# EasyEDA Pro project _SHA-PCB V1.1  30 23_2024-08-26.epro, schematic Schematic1

## Sheets
1 P1: Create Date: 2024-07-31; Page Name: P1; Project Name: SHA-PCB V1.1 30 23; Schematic Name: Schematic1; Update Date: 2024-07-31; Company: Sai Automations; Drawed: EasyEDA Pro; Page Size: A4; Part Number: JLCPCB-002; Reviewed: EasyEDA Pro; Version: V0.1
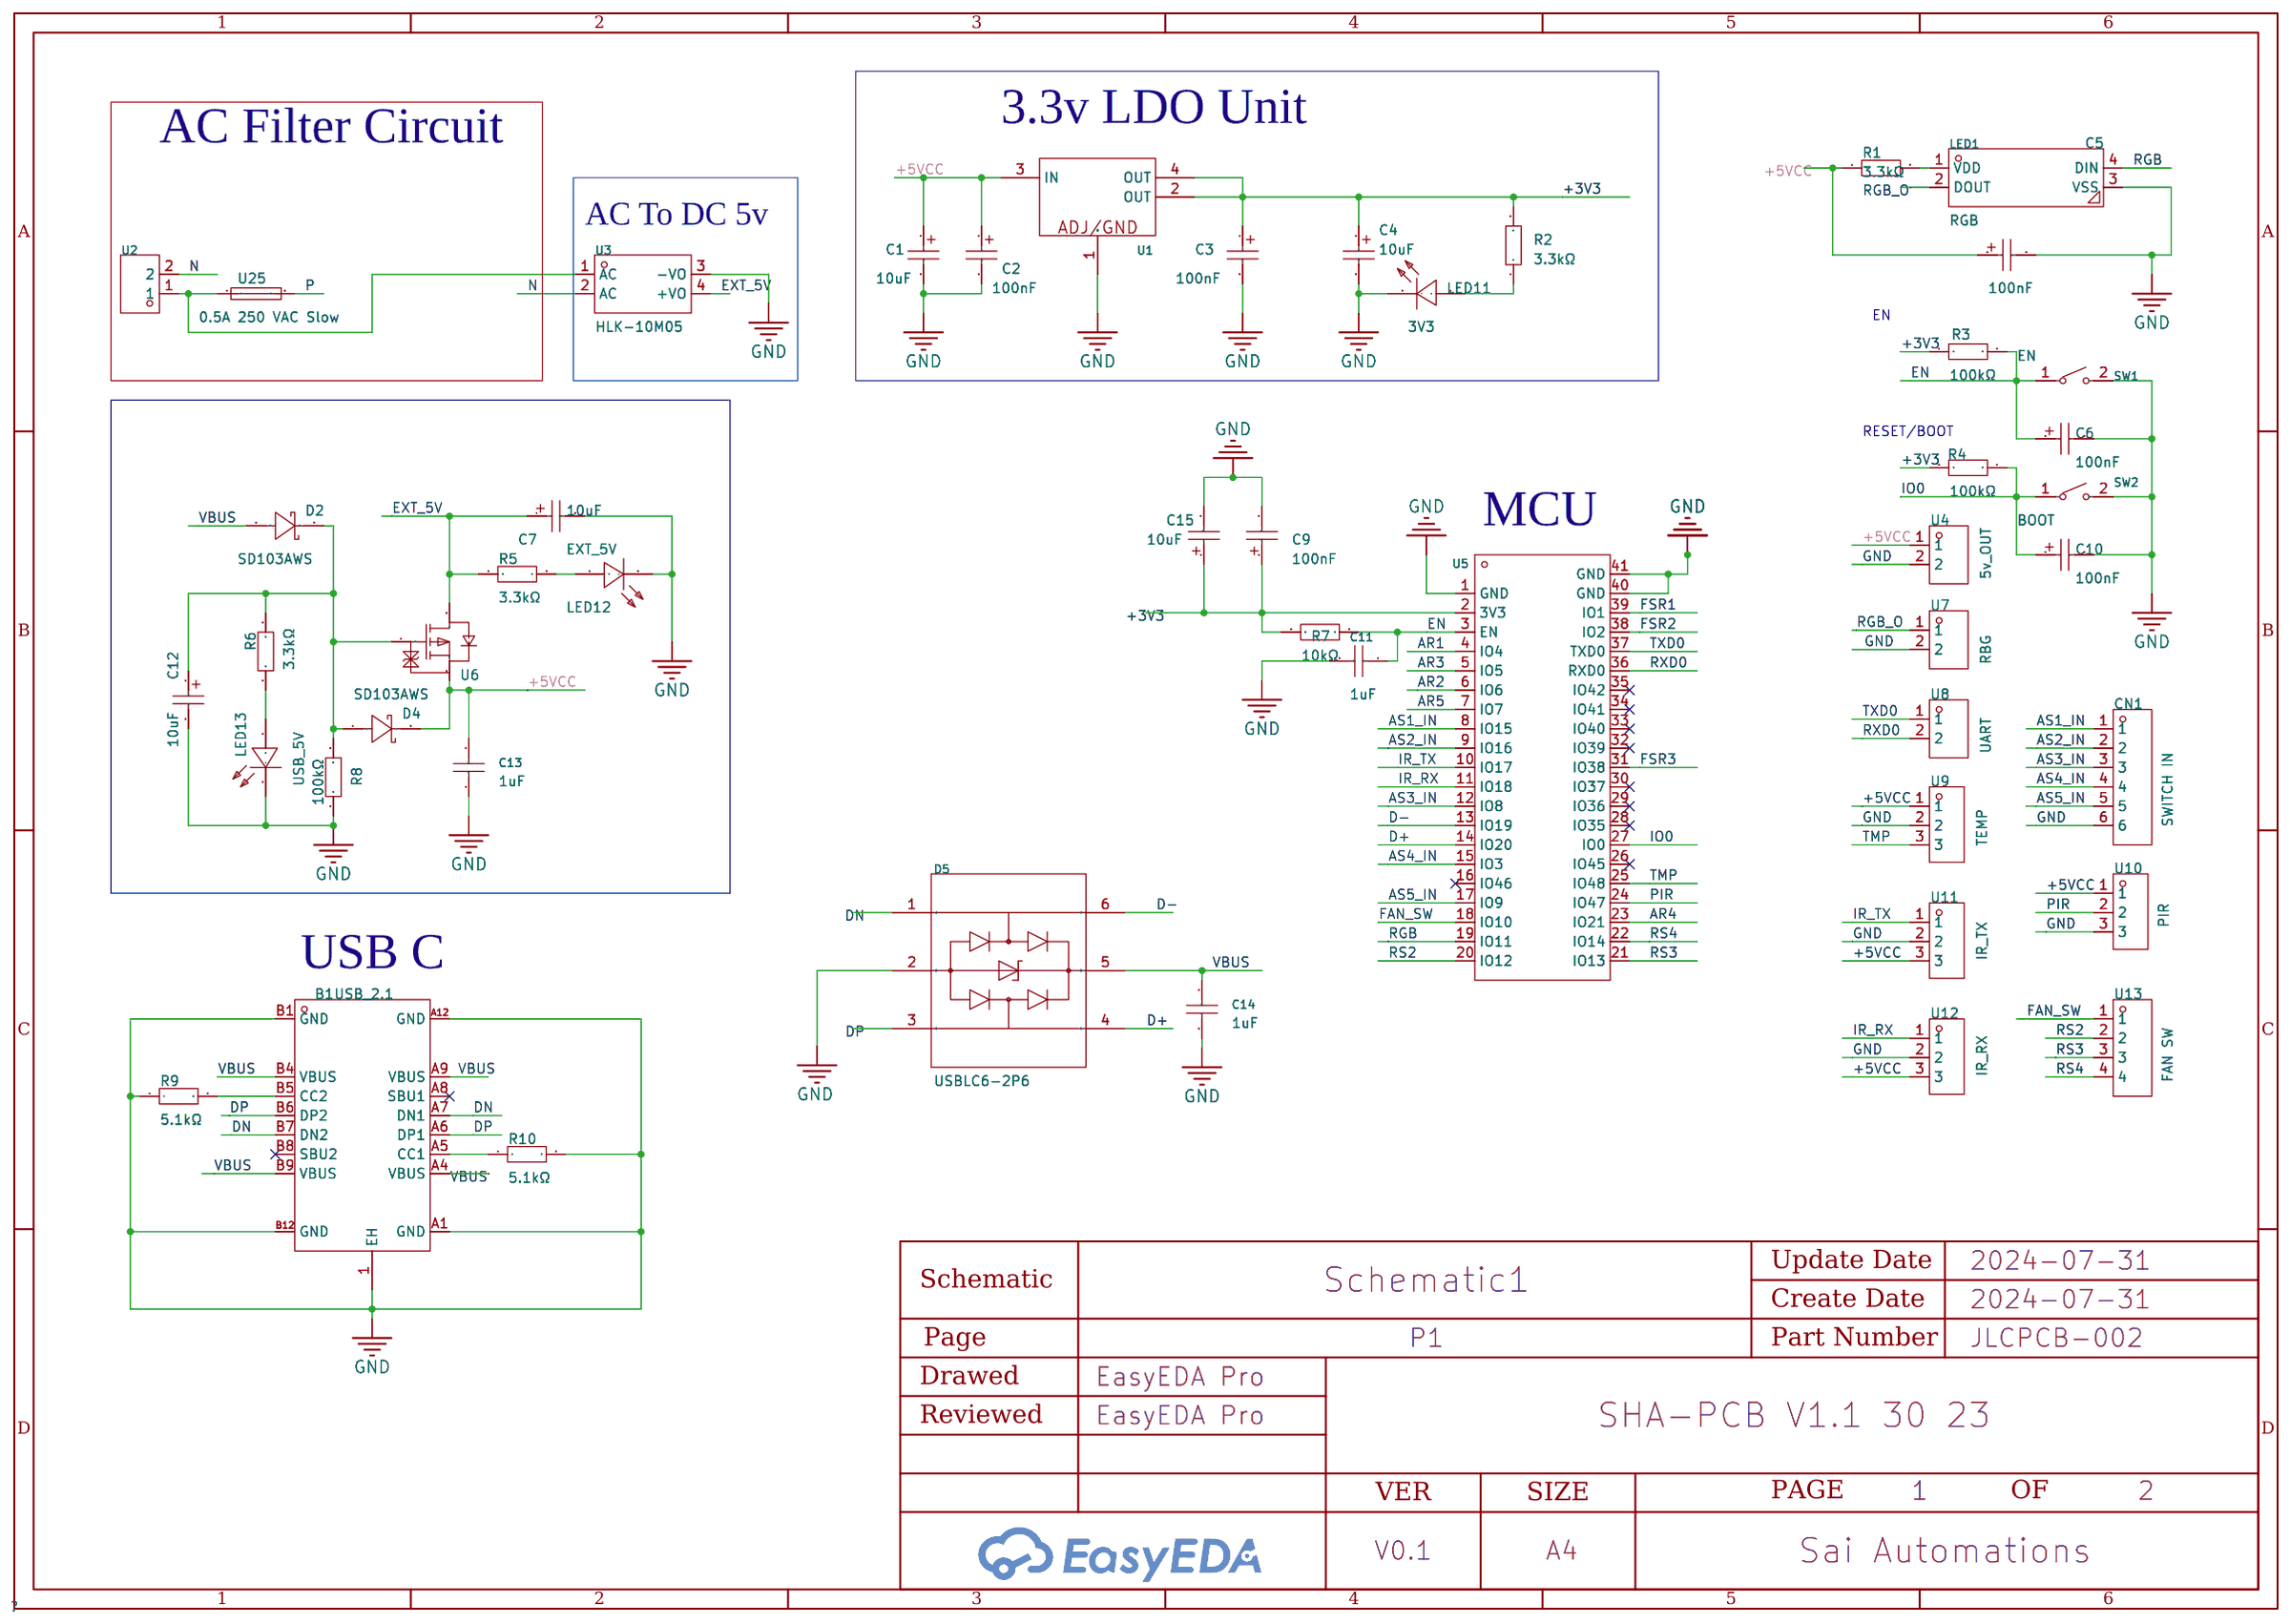
[diagram p0: P1]
2 P2: Create Date: 2024-01-13; Page Name: P2; Project Name: SHA-PCB V1.1; Update Date: 2024-07-18
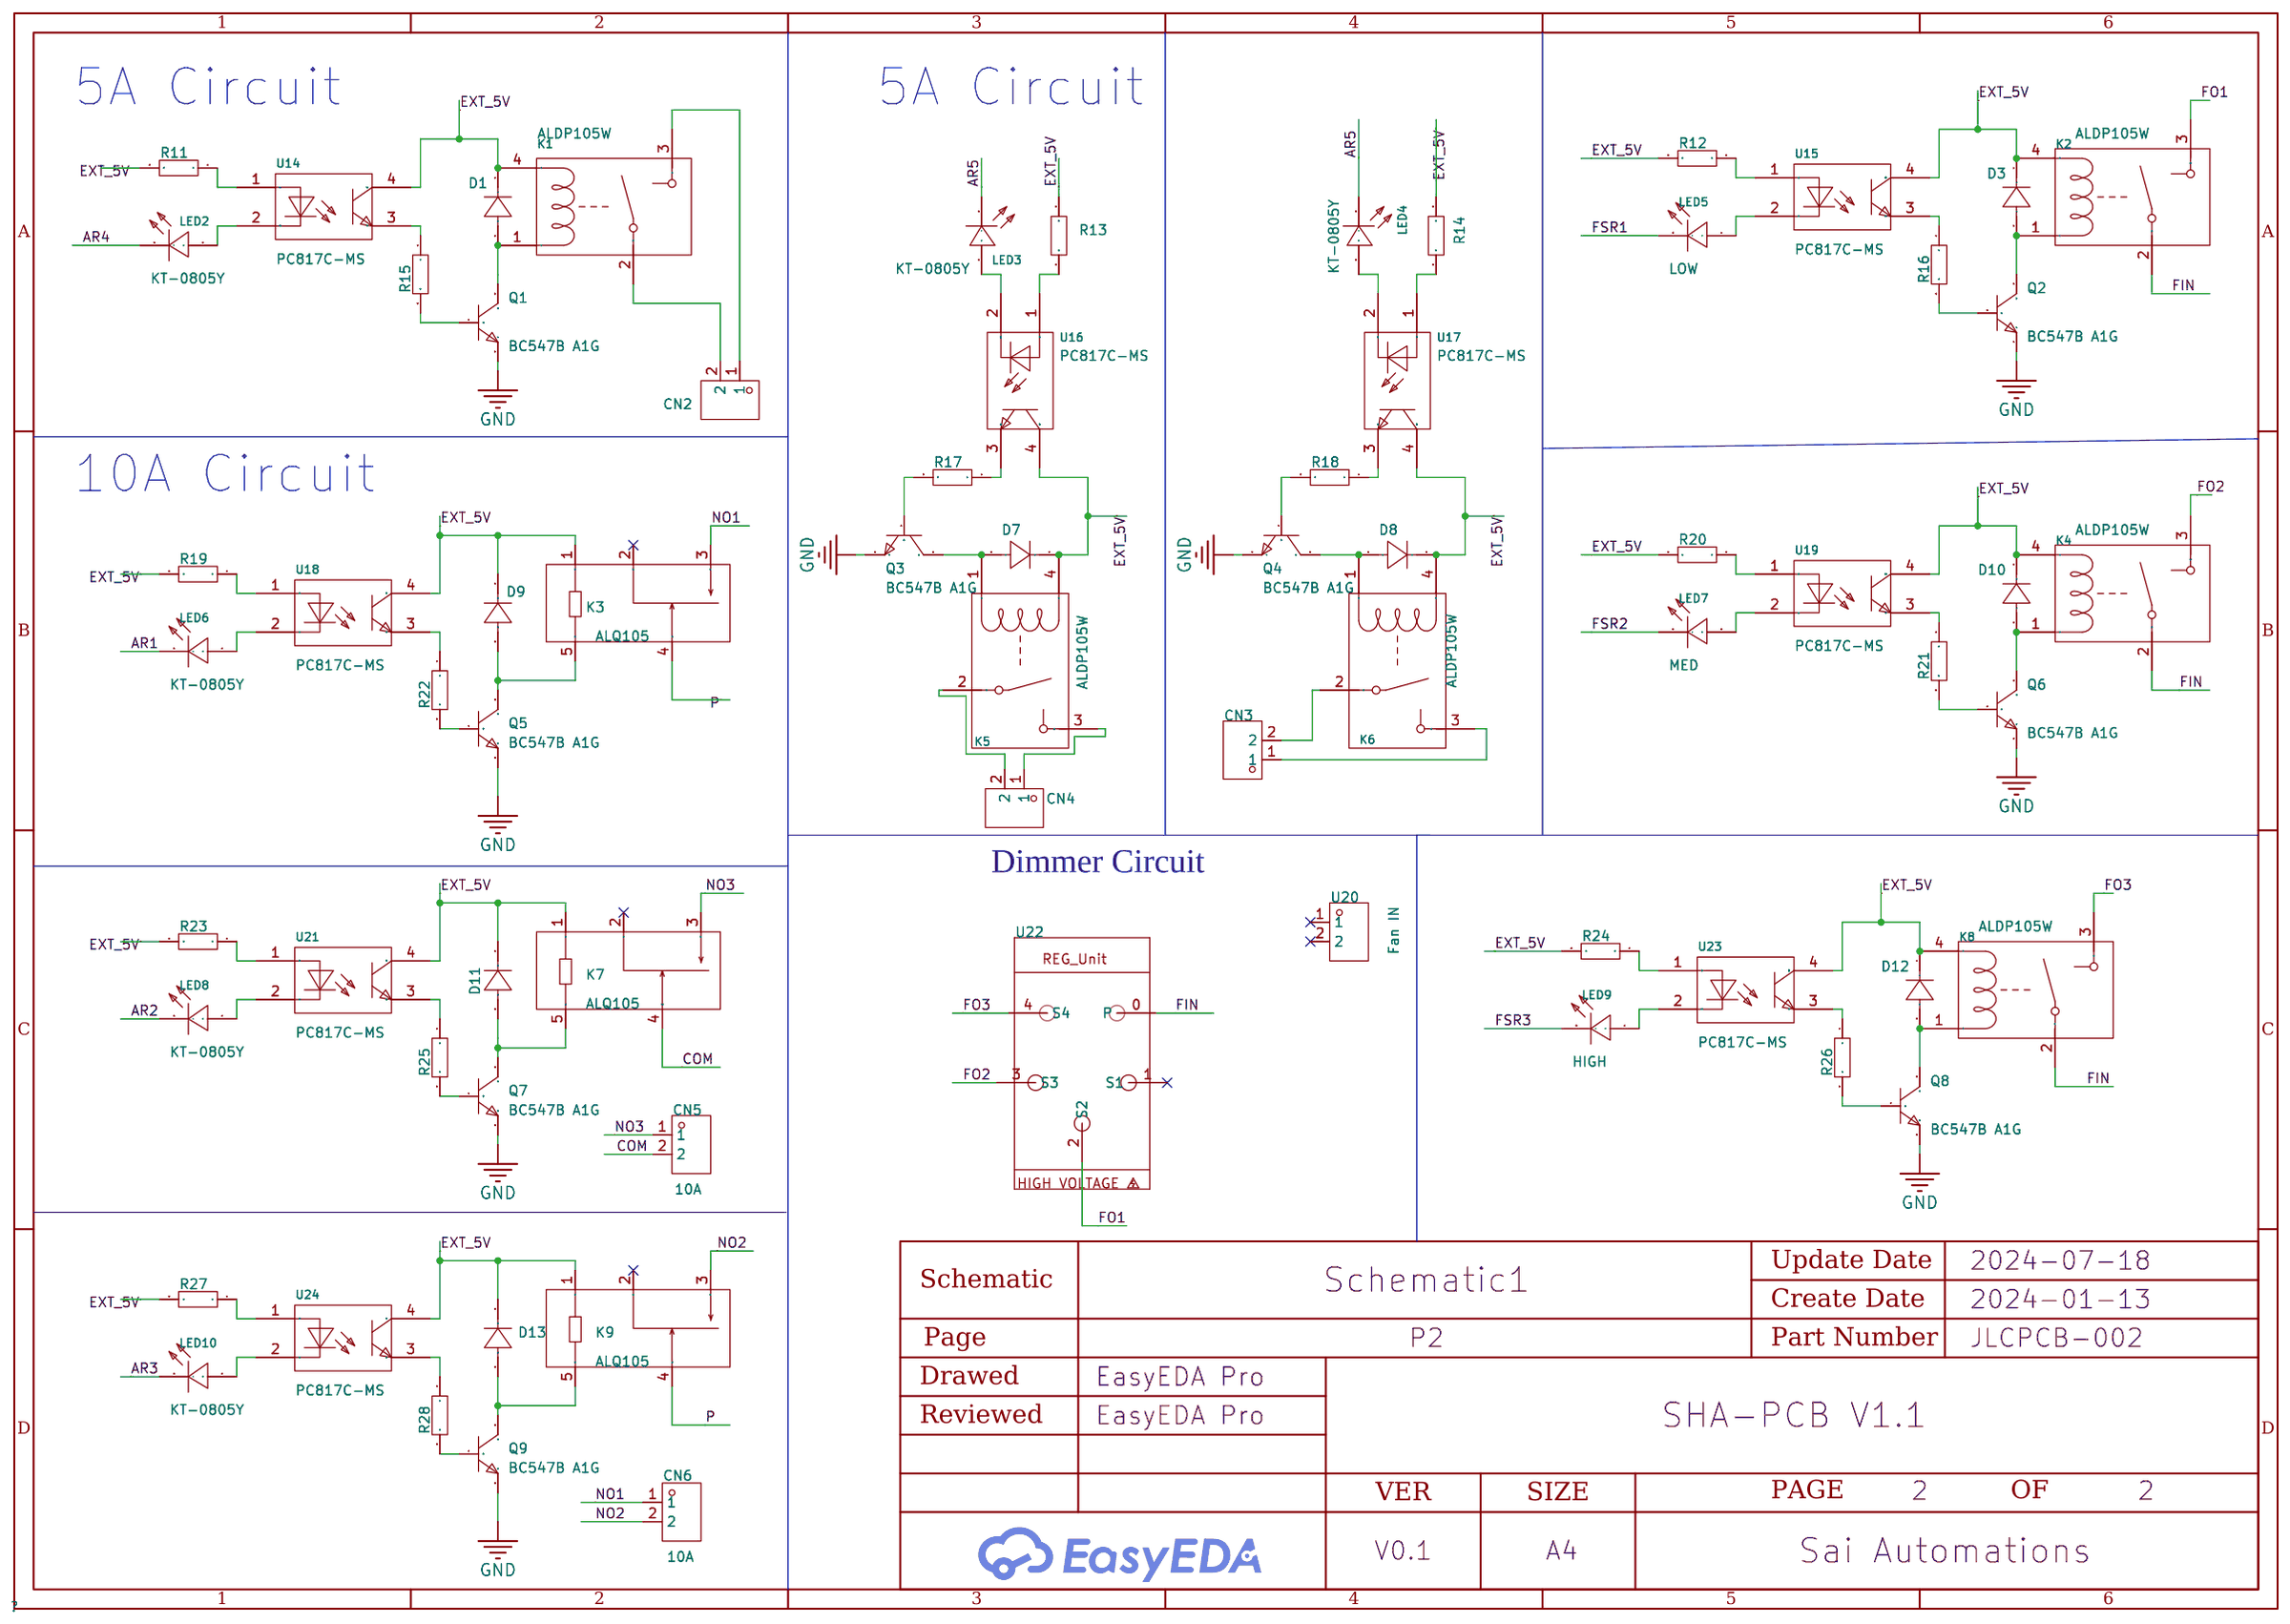
[diagram p1: P2]

## Parts
sheet P1
B1  USB_2.1  [TYPE-C-SMD_SBC-160S1A-20-S412]
C1  10uF  [CASE-A_3216]
C2  100nF  [CASE-A_3216]
C3  100nF  [CASE-A_3216]
C4  10uF  [CASE-A_3216]
C5  100nF  [CASE-A_3216]
C6  100nF  [CASE-A_3216]
C7  10uF  [CASE-A_3216]
C9  100nF  [CASE-A_3216]
C10  100nF  [CASE-A_3216]
C11  1uF  [C0402]
C12  10uF  [CASE-A_3216]
C13  1uF  [C0402]
C14  1uF  [C0402]
C15  10uF  [CASE-A_3216]
CN1  SWITCH IN  [CONN-TH_B6B-PH-K-S-GW]
D2  SD103AWS  [SOD-323_L1.8-W1.3-LS2.5-FD]
D4  SD103AWS  [SOD-323_L1.8-W1.3-LS2.5-FD]
D5  USBLC6-2P6  [SOT-666-6_L1.6-W1.2-P0.50-LS1.6-BR]
LED1  RGB  [LED-SMD_4P-L5.0-W5.0-BL_TC5050RGB]
LED11  3V3  [LED0805-R-RD]
LED12  EXT_5V  [LED0805-R-RD]
LED13  USB_5V  [LED0805-R-RD]
R1  3.3kΩ  [R0402]
R2  3.3kΩ  [R0402]
R3  100kΩ  [R0402]
R4  100kΩ  [R0402]
R5  3.3kΩ  [R0402]
R6  3.3kΩ  [R0402]
R7  10kΩ  [R0402]
R8  100kΩ  [R0402]
R9  5.1kΩ  [R0402]
R10  5.1kΩ  [R0402]
SW1  EN  [SW-SMD_L3.9-W3.0-P4.45]
SW2  BOOT  [SW-SMD_L3.9-W3.0-P4.45]
U1  AMS1117-3.3  [SOT-223-3_L6.4-W3.5-P2.30-LS7.0-BR]
U2  XY126V-5.0-2P  [CONN-TH_XY126V-5.0-2P]
U3  HLK-10M05  [PWRM-TH_HLK-10M05]
U4  5v_OUT  [CONN-TH_2P-P2.00_2B-PH-KL]
U5  ESP32-S3-WROOM-1-N4R8  [WIRELM-SMD_ESP32-S3-WROOM-1]
U6  CJ3139KDW-ES  [SOT-323-3_L2.1-W1.3-P1.30-LS2.3-BR]
U7  RBG  [CONN-TH_2P-P2.00_2B-PH-KL]
U8  UART  [CONN-TH_2P-P2.00_2B-PH-KL]
U9  TEMP  [3 PIN JST PH]
U10  PIR  [3 PIN JST PH]
U11  IR_TX  [3 PIN JST PH]
U12  IR_RX  [3 PIN JST PH]
U13  FAN SW  [JST 4PIN]
U25  0.5A 250 VAC Slow  [TH_2P-BLX-A]
sheet P2
CN2  XY2500R-G-3.5-2P  [CONN-TH_XY2500R-G-3.5-2P]
CN3  XY2500R-G-3.5-2P  [CONN-TH_XY2500R-G-3.5-2P]
CN4  XY2500R-G-3.5-2P  [CONN-TH_XY2500R-G-3.5-2P]
CN5  10A  [CONN-TH_2P-P5.08_XY2500R-D5.08-2P]
CN6  10A  [CONN-TH_XY2500R-G-3.5-2P]
D1  -  [SMA_L4.4-W2.8-LS5.4-RD]
D3  -  [SMA_L4.4-W2.8-LS5.4-RD]
D7  -  [SMA_L4.4-W2.8-LS5.4-RD]
D8  -  [SMA_L4.4-W2.8-LS5.4-RD]
D9  -  [SMA_L4.4-W2.8-LS5.4-RD]
D10  -  [SMA_L4.4-W2.8-LS5.4-RD]
D11  -  [SMA_L4.4-W2.8-LS5.4-RD]
D12  -  [SMA_L4.4-W2.8-LS5.4-RD]
D13  -  [SMA_L4.4-W2.8-LS5.4-RD]
K1  ALDP105W  [RELAY-TH_ALDP1XXW]
K2  ALDP105W  [RELAY-TH_ALDP1XXW]
K3  ALQ105  [RELAY-TH_ALQ1XX]
K4  ALDP105W  [RELAY-TH_ALDP1XXW]
K5  ALDP105W  [RELAY-TH_ALDP1XXW]
K6  ALDP105W  [RELAY-TH_ALDP1XXW]
K7  ALQ105  [RELAY-TH_ALQ1XX]
K8  ALDP105W  [RELAY-TH_ALDP1XXW]
K9  ALQ105  [RELAY-TH_ALQ1XX]
LED2  KT-0805Y  [LED0805-R-RD]
LED3  KT-0805Y  [LED0805-R-RD]
LED4  KT-0805Y  [LED0805-R-RD]
LED5  LOW  [LED0805-R-RD]
LED6  KT-0805Y  [LED0805-R-RD]
LED7  MED  [LED0805-R-RD]
LED8  KT-0805Y  [LED0805-R-RD]
LED9  HIGH  [LED0805-R-RD]
LED10  KT-0805Y  [LED0805-R-RD]
Q1  BC547B A1G  [SOT-23_L2.9-W1.3-P1.90-LS2.4-BR]
Q2  BC547B A1G  [SOT-23_L2.9-W1.3-P1.90-LS2.4-BR]
Q3  BC547B A1G  [SOT-23_L2.9-W1.3-P1.90-LS2.4-BR]
Q4  BC547B A1G  [SOT-23_L2.9-W1.3-P1.90-LS2.4-BR]
Q5  BC547B A1G  [SOT-23_L2.9-W1.3-P1.90-LS2.4-BR]
Q6  BC547B A1G  [SOT-23_L2.9-W1.3-P1.90-LS2.4-BR]
Q7  BC547B A1G  [SOT-23_L2.9-W1.3-P1.90-LS2.4-BR]
Q8  BC547B A1G  [SOT-23_L2.9-W1.3-P1.90-LS2.4-BR]
Q9  BC547B A1G  [SOT-23_L2.9-W1.3-P1.90-LS2.4-BR]
R11  1kΩ  [R0402]
R12  1kΩ  [R0402]
R13  1kΩ  [R0402]
R14  1kΩ  [R0402]
R15  1kΩ  [R0402]
R16  1kΩ  [R0402]
R17  1kΩ  [R0402]
R18  1kΩ  [R0402]
R19  1kΩ  [R0402]
R20  1kΩ  [R0402]
R21  1kΩ  [R0402]
R22  1kΩ  [R0402]
R23  1kΩ  [R0402]
R24  1kΩ  [R0402]
R25  1kΩ  [R0402]
R26  1kΩ  [R0402]
R27  1kΩ  [R0402]
R28  1kΩ  [R0402]
U14  PC817C-MS  [SOP-4_L6.5-W4.6-P2.54-LS10.0]
U15  PC817C-MS  [SOP-4_L6.5-W4.6-P2.54-LS10.0]
U16  PC817C-MS  [SOP-4_L6.5-W4.6-P2.54-LS10.0]
U17  PC817C-MS  [SOP-4_L6.5-W4.6-P2.54-LS10.0]
U18  PC817C-MS  [SOP-4_L6.5-W4.6-P2.54-LS10.0]
U19  PC817C-MS  [SOP-4_L6.5-W4.6-P2.54-LS10.0]
U20  Fan IN  [CONN-TH_2P-P5.08_DB128L-5.08-2P]
U21  PC817C-MS  [SOP-4_L6.5-W4.6-P2.54-LS10.0]
U22  -  [REG 1]
U23  PC817C-MS  [SOP-4_L6.5-W4.6-P2.54-LS10.0]
U24  PC817C-MS  [SOP-4_L6.5-W4.6-P2.54-LS10.0]

## Library data of the parts
B1 = USB4105-GF-A: Supplier Part: C3020560; Supplier Footprint: SMD; JLCPCB Part Class: Extended Part; Datasheet: https://atta.szlcsc.com/upload/public/pdf/source/20220520/320CE7E4F2C5E8A05ADD2DAC45B818D3.pdf; Supplier: LCSC
C1 C4 C7 C12 C15 = TAJA106K010RNJ: Capacitance: Tolerance:±10% Tolerance:±10% Rated Voltage: Equivalent Series Resistance(ESR):3Ω@100kHz Operating Temperature:-55℃~+125℃ Operating Temperature:-55℃~+125℃; LCSC Part Name: 10uF ±10% 10V; Supplier Part: C7177; Manufacturer: Kyocera AVX; Supplier Footprint: CASE-A-3216; JLCPCB Part Class: Extended Part; Datasheet: https://atta.szlcsc.com/upload/public/pdf/source/20160107/1457707748330.pdf; Supplier: LCSC; Tolerance: ±10%; Equivalent Series Resistance(ESR): 3Ω@100kHz; Operating Temperature: -55℃~+125℃
C2 C3 C5 C6 C9 C10 = TAJA104K035RNJ: Capacitance: Tolerance:±10% Tolerance:±10% Rated Voltage: Equivalent Series Resistance(ESR):24Ω@100kHz Operating Temperature:-55℃~+125℃ Operating Temperature:-55℃~+125℃; LCSC Part Name: 100nF ±10% 35V; Supplier Part: C7173; Manufacturer: Kyocera AVX; JLCPCB Part Class: Extended Part; Datasheet: https://atta.szlcsc.com/upload/public/pdf/source/20160107/1457707748183.pdf; Supplier: LCSC; Tolerance: ±10%; Equivalent Series Resistance(ESR): 24Ω@100kHz; Operating Temperature: -55℃~+125℃
C11 C13 C14 = CL05A105KP5NNNC: Capacitance: Tolerance:±10% Tolerance:±10% Voltage Rated: Temperature Coefficient:; LCSC Part Name: 1uF ±10% 10V; Supplier Part: C14445; Manufacturer: SAMSUNG(三星); Supplier Footprint: 0402; JLCPCB Part Class: Extended Part; Datasheet: https://atta.szlcsc.com/upload/public/pdf/source/20160218/1457707763339.pdf; Supplier: LCSC; Tolerance: ±10%
CN1 = B6B-PH-K-S-GW: Pins Structure:1x6P Pitch:2mm Mounting Style:Straight Reference Series:PH Number of Pins:6P Number of Rows:1 Number of PINs Per Row:6 Row Spacing:- Current Rating (Max):2A Contact Material:Brass Contact Plating:Tin Operating Temperature Range:-25℃~+85℃ Op; LCSC Part Name: 1x6P 间距:2mm 直插 系列:PH; Supplier Part: C495261; Manufacturer: JST; Supplier Footprint: 插件,P=2mm; JLCPCB Part Class: Extended Part; Datasheet: https://atta.szlcsc.com/upload/public/pdf/source/20200407/C495261_50C7EC6600FEF5142756BA70D96A0727.pdf; Supplier: LCSC; Pins Structure: 1x6P; Pitch: 2mm; Mounting Style: Straight; Reference Series: PH; Number of Pins: 6P; Number of Rows: 1; Number of PINs Per Row: 6; Current Rating (Max): 2A; Contact Material: Brass; Contact Plating: Tin; Operating Temperature Range: -25℃~+85℃; Rated Voltage (Max): 100V; Plastic Material: PA66; Flame Retardant Rating: UL94V-0; Supplementary Features: 打K脚; Colour: White; Z-Height of the Board: 6mm; X-Length of Bottom Edge on Board (Spacing Line): 13.9mm; Y-Width of Bottom Edge on Board: 4.5mm
D2 D4 = SD103AWS_C777800: Supplier Part: C777800; Manufacturer: HT(金誉); Supplier Footprint: SOD-323; JLCPCB Part Class: Extended Part; Datasheet: https://atta.szlcsc.com/upload/public/pdf/source/20200911/C777800_C9DC5B39338AA3E0DC005DC2BC619FD8.pdf; Supplier: LCSC
D5 = USBLC6-2P6_C15999: polarity:Unidirectional Reverse Stand-Off Voltage (Vrwm):5.25V Maximum Clamping Voltage:17V Peak Pulse Current (Ipp)@10/1000us:5A Breakdown Voltage:6V Number of Lines:Dual Type:ESD; LCSC Part Name: 单向ESD; Supplier Part: C15999; Manufacturer: ST(意法半导体); Supplier Footprint: SOT-666-6; JLCPCB Part Class: Extended Part; Datasheet: https://atta.szlcsc.com/upload/public/pdf/source/20140724/1457707160627.pdf; Supplier: LCSC; polarity: Unidirectional; Reverse Stand-Off Voltage (Vrwm): 5.25V; Maximum Clamping Voltage: 17V; Peak Pulse Current (Ipp)@10/1000us: 5A; Breakdown Voltage: 6V; Number of Lines: Dual; Type: ESD
LED1 = WS2812B-B/W: Emitted Color:RGB; LCSC Part Name: RGB三色; Supplier Part: C114586; Manufacturer: worldsemi; Supplier Footprint: SMD5050; JLCPCB Part Class: Extended Part; Datasheet: https://atta.szlcsc.com/upload/public/pdf/source/20200615/C114586_26EB6813EC9F2A3F6C7FBB2AD75DE01F.pdf; Supplier: LCSC
LED2-LED13 = KT-0805Y: Emitted Color:Yellow Diode Configuration:- Forward Current:- Power Dissipation:- Lens Color:- Dominant Wavelength:- Dominant Wavelength:- Peak Wavelength:- Color Temperature:- Color Temperature:- Viewing Angle:- Mounting Sytle:- Operating Temperature:- Op; LCSC Part Name: 0805 黄灯 高亮; Supplier Part: C2296; Manufacturer: KENTO; Supplier Footprint: 0805; JLCPCB Part Class: Basic Part; Datasheet: https://atta.szlcsc.com/upload/public/pdf/source/20160421/1461205044170.pdf; Supplier: LCSC; Emitted Color: Yellow
R1 R2 R5 R6 = RC0402FR-073K3L: Type:Thick Film Resistors Resistance: Tolerance:±1% Tolerance:±1% Power(Watts): Overload Voltage (Max): Temperature Coefficient:±100ppm/℃ Temperature Coefficient:±100ppm/℃ Operating Temperature Range:-55℃~+155℃ Operating Temperature Range:-55℃~+155℃; LCSC Part Name: 厚膜电阻 3.3kΩ ±1% 62.5mW; Supplier Part: C137992; Manufacturer: YAGEO(国巨); Supplier Footprint: 0402; JLCPCB Part Class: Extended Part; Datasheet: https://atta.szlcsc.com/upload/public/pdf/source/20181009/C309620_DA5935B6E1D48212CB7A533FE518B3C2.pdf; Supplier: LCSC; Type: Thick Film Resistors; Tolerance: ±1%; Temperature Coefficient: ±100ppm/℃; Operating Temperature Range: -55℃~+155℃
R3 R4 R8 = RC0402FR-07100KL: Type:Thick Film Resistors Resistance: Tolerance:±1% Tolerance:±1% Power(Watts): Overload Voltage (Max): Temperature Coefficient:±100ppm/℃ Temperature Coefficient:±100ppm/℃ Operating Temperature Range:-55℃~+155℃ Operating Temperature Range:-55℃~+155℃; LCSC Part Name: 厚膜电阻 100kΩ ±1% 62.5mW; Supplier Part: C60491; Manufacturer: YAGEO(国巨); Supplier Footprint: 0402; JLCPCB Part Class: Extended Part; Datasheet: https://atta.szlcsc.com/upload/public/pdf/source/20180927/C295883_E8D83085EA81BD7DE0B2B681138C15EE.pdf; Supplier: LCSC; Type: Thick Film Resistors; Tolerance: ±1%; Temperature Coefficient: ±100ppm/℃; Operating Temperature Range: -55℃~+155℃
R7 = RC0402FR-0710KL: Type:Thick Film Resistors Resistance: Tolerance:±1% Tolerance:±1% Power(Watts): Temperature Coefficient:±100ppm/℃ Temperature Coefficient:±100ppm/℃ Overload Voltage (Max): Operating Temperature Range:-55℃~+155℃ Operating Temperature Range:-55℃~+155℃; LCSC Part Name: 10kΩ ±1% 62.5mW; Supplier Part: C60490; Manufacturer: YAGEO(国巨); Supplier Footprint: 0402; JLCPCB Part Class: Extended Part; Datasheet: https://atta.szlcsc.com/upload/public/pdf/source/20170606/1496716515432.pdf; Supplier: LCSC; Type: Thick Film Resistors; Tolerance: ±1%; Temperature Coefficient: ±100ppm/℃; Operating Temperature Range: -55℃~+155℃
R9 R10 = RC0402FR-075K1L: Type:Thick Film Resistors Resistance: Tolerance:±1% Tolerance:±1% Power(Watts): Overload Voltage (Max): Temperature Coefficient:±100ppm/℃ Temperature Coefficient:±100ppm/℃ Operating Temperature Range:-55℃~+155℃ Operating Temperature Range:-55℃~+155℃; LCSC Part Name: 厚膜电阻 5.1kΩ ±1% 62.5mW; Supplier Part: C105872; Manufacturer: YAGEO(国巨); Supplier Footprint: 0402; JLCPCB Part Class: Extended Part; Datasheet: https://atta.szlcsc.com/upload/public/pdf/source/20180821/C275644_0D56F95EFF785E7D9A1FEF436B37DA78.pdf; Supplier: LCSC; Type: Thick Film Resistors; Tolerance: ±1%; Temperature Coefficient: ±100ppm/℃; Operating Temperature Range: -55℃~+155℃
SW1 SW2 = TS-1088R-02526: Circuit:SPST Actuator Style:Round Button Mounting Style:Brick nogging Switch Length:3.9mm Switch Width:2.93mm Switch Height:2.5mm Contact Current:50mA Voltage Rating (DC):12V With Lamp:- Mechanical Life:-; LCSC Part Name: 3.9*2.93*2.5mm 立贴 轻触开关; Supplier Part: C455281; Manufacturer: XUNPU(讯普); Supplier Footprint: SMD,3x4mm; JLCPCB Part Class: Extended Part; Datasheet: https://atta.szlcsc.com/upload/public/pdf/source/20191118/C455281_EC5379764BC1462550DF64BBBFEA9579.pdf; Supplier: LCSC; Circuit: SPST; Actuator Style: Round Button; Mounting Style: Brick nogging; Switch Length: 3.9mm; Switch Width: 2.93mm; Switch Height: 2.5mm; Contact Current: 50mA; Voltage Rating (DC): 12V
U1 = AMS1117-3.3: Supplier Part: C2992570; Manufacturer: 国芯佳品; Supplier Footprint: SOT-223-3; JLCPCB Part Class: Extended Part; Datasheet: https://atta.szlcsc.com/upload/public/pdf/source/20220729/0D21C21EC310E4778671BF6BAE438640.pdf; Supplier: LCSC
U2 = XY126V-5.0-2P: Structure:1x2P Pitch:5mm Color:Green Mounting Style:Straight Current Rating (Max):10A Voltage Rating (Max):300V Number of Pins:2P Number of Rows:1 Wire Gauge - AWG:14~26 Wire Gauge - AWG:14~26 Wire Gauge - mm2:2.5 Wire Gauge - mm2:2.5 Number of PINs Per R; LCSC Part Name: 5mm 1x2P 排数:1 每排P数:2 直插 可拼接 弹片保护式 PA66 铜镀锡; Supplier Part: C557646; Manufacturer: XINLAIYA(新莱亚); Supplier Footprint: 插件,P=5mm; JLCPCB Part Class: Extended Part; Datasheet: https://atta.szlcsc.com/upload/public/pdf/source/20200527/C557646_26587B40573B14A0249F4669B975AF1D.pdf; Supplier: LCSC; Structure: 1x2P; Pitch: 5mm; Color: Green; Mounting Style: Straight; Current Rating (Max): 10A; Voltage Rating (Max): 300V; Number of Pins: 2P; Number of Rows: 1; Wire Gauge - AWG: 14~26; Wire Gauge - mm2: 2.5; Number of PINs Per Row: 2
U3 = HLK-10M05: Conversion Type:AC-DC Function:降压型 Input Voltage(AC):90VAC~265VAC Input Voltage(AC):90VAC~265VAC Input Voltage(DC):120V~350V Input Voltage(DC):120V~350V Output Voltage:5V Output Voltage:5V Output Current (Max):2A Output Current (Max):2A Output Power:10W I; Supplier Part: C403745; Manufacturer: HI-LINK(海凌科); Supplier Footprint: 插件; JLCPCB Part Class: Extended Part; Datasheet: https://atta.szlcsc.com/upload/public/pdf/source/20230506/347354FD6825E03F8DF380E9A4C93618.pdf; Supplier: LCSC; Conversion Type: AC-DC; Function: 降压型; Input Voltage(AC): 90VAC~265VAC; Input Voltage(DC): 120V~350V; Output Voltage: 5V; Output Current (Max): 2A; Output Power: 10W; Isolated Or Voltage Regulation: 隔离稳压; Output Channel: 1; Insulated Voltage: 3kV@AC; Conversion Efficiency: 80%; Feature: Overcurrent Protection；Short-Circuit Protection
U4 U7 U8 = B2B-PH-KL(LF)(SN): Pins Structure:1x2P Pitch:2mm Mounting Style:Straight Reference Series:PH Number of Pins:2P Number of Rows:1 Number of PINs Per Row:2 Row Spacing:- Current Rating (Max):2A Contact Material:Copper Alloy Contact Plating:Tin Operating Temperature Range:-25℃~; LCSC Part Name: 1x2P 间距:2mm 直插 系列:PH; Supplier Part: C2683610; Manufacturer: JST; Supplier Footprint: 插件,P=2mm; JLCPCB Part Class: Extended Part; Datasheet: https://atta.szlcsc.com/upload/public/pdf/source/20210107/C2683610_0E92DDCF1751629406007459013A6E61.pdf; Supplier: LCSC; Pins Structure: 1x2P; Pitch: 2mm; Mounting Style: Straight; Reference Series: PH; Number of Pins: 2P; Number of Rows: 1; Number of PINs Per Row: 2; Current Rating (Max): 2A; Contact Material: Copper Alloy; Contact Plating: Tin; Operating Temperature Range: -25℃~+85℃; Rated Voltage (Max): 100V; Plastic Material: PA66; Flame Retardant Rating: UL94V-0; Supplementary Features: 打K脚; Colour: Gray; Z-Height of the Board: 6mm; X-Length of Bottom Edge on Board (Spacing Line): 5.9mm; Y-Width of Bottom Edge on Board: 4.5mm
U5 = ESP32-S3-WROOM-1-N4R8: LCSC Part Name: 通用型Wi-Fi+低功耗蓝牙MCU模组; Supplier Part: C2913200; Manufacturer: ESPRESSIF(乐鑫); Supplier Footprint: SMD,18x25.5mm; JLCPCB Part Class: Extended Part; Datasheet: https://atta.szlcsc.com/upload/public/pdf/source/20220628/A2AC12B3C87735CAEB7EBE2DBE80936C.pdf; Supplier: LCSC
U6 = CJ3139KDW-ES: Drain Source Voltage (Vdss): Continuous Drain Current (Id):0.5A Power Dissipation (Pd):0.15W Drain Source On Resistance (RDS(on)@Vgs,Id):580mΩ Gate Threshold Voltage (Vgs(th)@Id):0.62V Total Gate Charge (Qg@Vgs):1.25nC Input Capacitance (Ciss@Vds):71pF Re; LCSC Part Name: 耐压:20V 电流:500mA; Supplier Part: C7528010; Manufacturer: ElecSuper(静芯微); Supplier Footprint: SOT-323; Datasheet: https://atta.szlcsc.com/upload/public/pdf/source/20230817/4F8B62A6F28A7D2AAC48D4B7D9377300.pdf; Supplier: LCSC; Continuous Drain Current (Id): 0.5A; Power Dissipation (Pd): 0.15W; Drain Source On Resistance (RDS(on)@Vgs,Id): 580mΩ; Gate Threshold Voltage (Vgs(th)@Id): 0.62V; Total Gate Charge (Qg@Vgs): 1.25nC; Input Capacitance (Ciss@Vds): 71pF; Reverse Transfer Capacitance (Crss@Vds): 15pF
U9-U12 = B4B-PH-K-S-GW: Pins Structure:1x4P Pitch:2mm Mounting Style:Straight Reference Series:PH Number of Pins:4P Number of Rows:1 Number of PINs Per Row:4 Row Spacing:- Current Rating (Max):2A Contact Material:Brass Contact Plating:Tin Operating Temperature Range:-25℃~+85℃ Op; LCSC Part Name: 1x4P 间距:2mm 直插 系列:PH; Supplier Part: C566011; Manufacturer: JST; Supplier Footprint: 插件,P=2mm; JLCPCB Part Class: Extended Part; Datasheet: https://atta.szlcsc.com/upload/public/pdf/source/20200721/C566011_D7A7E1FCE27087DADB9839A85D6B6EB3.pdf; Supplier: LCSC; Pins Structure: 1x4P; Pitch: 2mm; Mounting Style: Straight; Reference Series: PH; Number of Pins: 4P; Number of Rows: 1; Number of PINs Per Row: 4; Current Rating (Max): 2A; Contact Material: Brass; Contact Plating: Tin; Operating Temperature Range: -25℃~+85℃; Rated Voltage (Max): 100V; Plastic Material: PA66; Flame Retardant Rating: UL94V-0; Supplementary Features: 打K脚; Colour: White; Z-Height of the Board: 6mm; X-Length of Bottom Edge on Board (Spacing Line): 9.9mm; Y-Width of Bottom Edge on Board: 4.5mm
U13 = B4B-PH-KL(LF)(SN): Pins Structure:1x4P Pitch:2mm Mounting Style:Straight Reference Series:PH Number of Pins:4P Number of Rows:1 Number of PINs Per Row:4 Row Spacing:- Current Rating (Max):2A Contact Material:Copper Alloy Contact Plating:Tin Operating Temperature Range:-25℃~; LCSC Part Name: 1x4P 间距:2mm 直插 系列:PH; Supplier Part: C566009; Manufacturer: JST; Supplier Footprint: 插件,P=2mm; JLCPCB Part Class: Extended Part; Datasheet: https://atta.szlcsc.com/upload/public/pdf/source/20211104/B080E4C4A636413D84B9D4C3E542B2FB.pdf; Supplier: LCSC; Pins Structure: 1x4P; Pitch: 2mm; Mounting Style: Straight; Reference Series: PH; Number of Pins: 4P; Number of Rows: 1; Number of PINs Per Row: 4; Current Rating (Max): 2A; Contact Material: Copper Alloy; Contact Plating: Tin; Operating Temperature Range: -25℃~+85℃; Rated Voltage (Max): 100V; Plastic Material: PA66; Flame Retardant Rating: UL94V-0; Supplementary Features: 打K脚; Colour: Gray; Z-Height of the Board: 6mm; X-Length of Bottom Edge on Board (Spacing Line): 9.9mm; Y-Width of Bottom Edge on Board: 4.5mm
U25 = BLX-A保险座: Supplier Part: C9900000762; Supplier Footprint: 插件; JLCPCB Part Class: Extended Part; Supplier: LCSC
CN2-CN4 CN6 = XY2500R-G-3.5-2P: Connector Type:板端/Receptacle-Close Structure:1x2P Pitch:3.5mm Color:Green Mounting Style:Bend Number of Pins:2P Number of Rows:1 Number of PINs Per Row:2 Current Rating (Max):8A Voltage Rating (Max):300V Contact Material:Brass Contact Plating:Tin Operatin; LCSC Part Name: 1x2P 3.5mm 排数:1 每排P数:2; Supplier Part: C880572; Manufacturer: XINLAIYA(新莱亚); Supplier Footprint: 弯插,P=3.5mm; JLCPCB Part Class: Extended Part; Datasheet: https://atta.szlcsc.com/upload/public/pdf/source/20201013/C880572_6BE3C892F898A2C15A6190F0C52877AF.pdf; Supplier: LCSC; Connector Type: 板端/Receptacle-Close; Structure: 1x2P; Pitch: 3.5mm; Color: Green; Mounting Style: Bend; Number of Pins: 2P; Number of Rows: 1; Number of PINs Per Row: 2; Current Rating (Max): 8A; Voltage Rating (Max): 300V; Contact Material: Brass; Contact Plating: Tin
CN5 = XY2500R-D-5.08-2P: Connector Type:板端/Receptacle-Close Structure:1x2P Pitch:5.08mm Color:Green Mounting Style:Bend Number of Pins:2P Number of Rows:1 Number of PINs Per Row:2 Current Rating (Max):15A Voltage Rating (Max):300V Contact Material:Brass Contact Plating:Tin; LCSC Part Name: 1x2P 5.08mm 排数:1 每排P数:2; Supplier Part: C505824; Manufacturer: XINLAIYA(新莱亚); Supplier Footprint: 弯插,P=5.08mm; JLCPCB Part Class: Extended Part; Datasheet: https://atta.szlcsc.com/upload/public/pdf/source/20200331/C505818_9B86AF41F87BA5FBF7CBCD562F14E5CB.pdf; Supplier: LCSC; Connector Type: 板端/Receptacle-Close; Structure: 1x2P; Pitch: 5.08mm; Color: Green; Mounting Style: Bend; Number of Pins: 2P; Number of Rows: 1; Number of PINs Per Row: 2; Current Rating (Max): 15A; Voltage Rating (Max): 300V; Contact Material: Brass; Contact Plating: Tin
D1 D3 D7-D13 = 1N4007: Supplier Footprint: SMA(DO-214AC); Supplier Part: C727081; JLCPCB Part Class: Extended Part
K1 K2 K4-K6 K8 = ALDP105W: Contact Form:- Coil Type:; Supplier Part: C115717; Manufacturer: PANASONIC(松下); Supplier Footprint: 插件,7.2x20.5mm; JLCPCB Part Class: Extended Part; Datasheet: https://atta.szlcsc.com/upload/public/pdf/source/20190920/C115717_CD97EE7C23828DD0D1E43BB629F7AD43.pdf; Supplier: LCSC
K3 K7 K9 = ALQ105: Coil Voltage:5V Contact Form:一组转换:1C(SPDT-转换) Pin Number:- Contact Rating:- Maximum Switching Voltage:250V@AC Contact Material:AgNi Maximum Switching Current:10A Coil Type: Coil Resistance:- Contact Resistance:- Operate Time:20ms Release Time:20ms Operati; Supplier Part: C719517; Manufacturer: PANASONIC(松下); Supplier Footprint: 插件,10x20mm; JLCPCB Part Class: Extended Part; Datasheet: https://atta.szlcsc.com/upload/public/pdf/source/20210111/C719517_E569CB83AE74C77274A407DFBCBCE4D6.pdf; Supplier: LCSC; Coil Voltage: 5V; Contact Form: 一组转换:1C(SPDT-转换); Maximum Switching Voltage: 250V@AC; Contact Material: AgNi; Maximum Switching Current: 10A; Operate Time: 20ms; Release Time: 20ms; Operating Temperature: -40℃~+85℃
Q1-Q9 = S8050_NPN: Supplier Footprint: SOT-23
R11-R28 = RC0402FR-071KL: Type:Thick Film Resistors Resistance: Tolerance:±1% Tolerance:±1% Power(Watts): Temperature Coefficient:±100ppm/℃ Temperature Coefficient:±100ppm/℃ Overload Voltage (Max): Operating Temperature Range:-55℃~+155℃ Operating Temperature Range:-55℃~+155℃; LCSC Part Name: 1kΩ ±1% 62.5mW; Supplier Part: C106235; Manufacturer: YAGEO(国巨); Supplier Footprint: 0402; JLCPCB Part Class: Extended Part; Datasheet: https://atta.szlcsc.com/upload/public/pdf/source/20170518/1495085714666.pdf; Supplier: LCSC; Type: Thick Film Resistors; Tolerance: ±1%; Temperature Coefficient: ±100ppm/℃; Operating Temperature Range: -55℃~+155℃
U14-U19 U21 U23 U24 = PC817C-MS: Output Type:光电三极管 Forward Voltage:1.2V Output Current:50mA Reverse Voltage:6V Receiving End Voltage:35V Number of Outputs:1; Supplier Part: C7472816; Manufacturer: MSKSEMI(美森科); Supplier Footprint: SOP-4; Datasheet: https://atta.szlcsc.com/upload/public/pdf/source/20230808/1EA8C29C5E87B083B920D137BE30D122.pdf; Supplier: LCSC; Output Type: 光电三极管; Forward Voltage: 1.2V; Output Current: 50mA; Reverse Voltage: 6V; Receiving End Voltage: 35V; Number of Outputs: 1
U20 = DB128L-5.08-2P-GN-S: Structure:1x2P Pitch:5.08mm Color:Green Mounting Style:Straight Current Rating (Max):18A Voltage Rating (Max):250V Number of Pins:2P Number of Rows:1 Wire Gauge - AWG:12~30 Wire Gauge - AWG:12~30 Wire Gauge - mm2:2.5 Wire Gauge - mm2:2.5 Number of PINs Pe; LCSC Part Name: 5.08mm 1x2P 排数:1 每排P数:2 直插; Supplier Part: C395868; Manufacturer: DORABO(地博电气); Supplier Footprint: 插件,P=5.08mm; JLCPCB Part Class: Extended Part; Datasheet: https://atta.szlcsc.com/upload/public/pdf/source/20230106/B067FE0E641A396A370D47F93C345689.pdf; Supplier: LCSC; Structure: 1x2P; Pitch: 5.08mm; Color: Green; Mounting Style: Straight; Current Rating (Max): 18A; Voltage Rating (Max): 250V; Number of Pins: 2P; Number of Rows: 1; Wire Gauge - AWG: 12~30; Wire Gauge - mm2: 2.5; Number of PINs Per Row: 2; Operating Temperature Range: -40℃~+105℃
U22 = REG

## Nets
+3V3: C3.1 C4.1 C9.1 C15.1 R2.2 R3.1 R4.2 R7.2 U1.2(OUT) U1.4(OUT) U5.2(3V3)
+5VCC: C1.1 C2.1 C5.1 C13.1 D4.2(K) R1.1 U1.3(IN) U4.1 U6.2(S) U9.1 U10.1 U11.3 U12.3
GND: B1.1(EH) B1.A1(GND) B1.A12(GND) B1.B1(GND) B1.B12(GND) C1.2 C2.2 C3.2 C4.2 C5.2 C6.2 C7.2 C9.2 C10.2 C11.2 C12.2 C13.2 C14.2 C15.2 CN1.6 D5.2(GND) LED1.3(VSS) LED11.2(-) LED12.2(-) LED13.2(-) Q1.2(E) Q2.2(E) Q3.2(E) Q4.2(E) Q5.2(E) Q6.2(E) Q7.2(E) Q8.2(E) Q9.2(E) R8.1 R9.1 R10.2 SW1.2 SW2.2 U1.1(ADJ/GND) U3.3(-VO) U4.2 U5.1(GND) U5.40(GND) U5.41(GND) U7.2 U9.2 U10.3 U11.2 U12.2
VBUS: B1.A4(VBUS) B1.A9(VBUS) B1.B4(VBUS) B1.B9(VBUS) C14.1 D2.1(A) D5.5(VBUS)
AR1: LED6.2(-) U5.4(IO4)
AR2: LED8.2(-) U5.6(IO6)
AR3: LED10.2(-) U5.5(IO5)
AR4: LED2.2(-) U5.23(IO21)
AR5: LED3.2(-) LED4.2(-) U5.7(IO7)
AS1_IN: CN1.1 U5.8(IO15)
AS2_IN: CN1.2 U5.9(IO16)
AS3_IN: CN1.3 U5.12(IO8)
AS4_IN: CN1.4 U5.15(IO3)
AS5_IN: CN1.5 U5.17(IO9)
COM: CN5.2 K7.4(N.C.)
D+: D5.4(I/O2) U5.14(IO20)
D-: D5.6(I/O1) U5.13(IO19)
DN: B1.A7(DN1) B1.B7(DN2) D5.1(I/O1)
DP: B1.A6(DP1) B1.B6(DP2) D5.3(I/O2)
EN: C6.1 C11.1 R3.2 R7.1 SW1.1 U5.3(EN)
EXT_5V: C7.1 D1.1(K) D3.1(K) D7.1(K) D8.1(K) D9.1(K) D10.1(K) D11.1(K) D12.1(K) D13.1(K) K1.4 K2.4 K3.1 K4.4 K5.4 K6.4 K7.1 K8.4 K9.1 R5.1 R11.2 R12.2 R13.2 R14.2 R19.2 R20.2 R23.2 R24.2 R27.2 U3.4(+VO) U6.3(D) U14.4(COL) U15.4(COL) U16.4(COL) U17.4(COL) U18.4(COL) U19.4(COL) U21.4(COL) U23.4(COL) U24.4(COL)
FAN_SW: U5.18(IO10) U13.1
FIN: K2.2 K4.2 K8.2 U22.0(P)
FO1: K2.3 U22.2(S2)
FO2: K4.3 U22.3(S3)
FO3: K8.3 U22.4(S4)
FSR1: LED5.2(-) U5.39(IO1)
FSR2: LED7.2(-) U5.38(IO2)
FSR3: LED9.2(-) U5.31(IO38)
IO0: C10.1 R4.1 SW2.1 U5.27(IO0)
IR_RX: U5.11(IO18) U12.1
IR_TX: U5.10(IO17) U11.1
N: U2.2 U3.2(AC)
NO1: CN6.1 K3.3(N.O.)
NO2: CN6.2 K9.3(N.O.)
NO3: CN5.1 K7.3(N.O.)
P: K3.4(N.C.) K9.4(N.C.) U25.2
PIR: U5.24(IO47) U10.2
RGB: LED1.4(DIN) U5.19(IO11)
RGB_O: LED1.2(DOUT) U7.1
RS2: U5.20(IO12) U13.2
RS3: U5.21(IO13) U13.3
RS4: U5.22(IO14) U13.4
RXD0: U5.36(RXD0) U8.2
TMP: U5.25(IO48) U9.3
TXD0: U5.37(TXD0) U8.1
$1N19522: LED12.1(+) R5.2
$1N20222: LED13.1(+) R6.2
$1N20581: C12.1 D2.2(K) D4.1(A) R6.1 R8.2 U6.1(G)
$1N21974: LED11.1(+) R2.1
$1N22604: LED1.1(VDD) R1.2
$1N26423: B1.B5(CC2) R9.2
$1N26495: B1.A5(CC1) R10.1
$2N6425: LED6.1(+) U18.2(CAT)
$2N6428: R19.1 U18.1(AN)
$2N6430: R22.1 U18.3(EMI)
$2N7885: LED2.1(+) U14.2(CAT)
$2N7886: R11.1 U14.1(AN)
$2N7887: R15.1 U14.3(EMI)
$2N7888: Q1.1(B) R15.2
$2N18449: Q5.1(B) R22.2
$2N18487: D9.2(A) K3.5 Q5.3(C)
$2N18765: D1.2(A) K1.1 Q1.3(C)
$2N18786: CN2.2 K1.2
$2N22813: LED9.1(+) U23.2(CAT)
$2N22814: R24.1 U23.1(AN)
$2N22817: R26.1 U23.3(EMI)
$2N22820: Q8.1(B) R26.2
$2N22829: D12.2(A) K8.1 Q8.3(C)
$2N24231: LED7.1(+) U19.2(CAT)
$2N24232: R20.1 U19.1(AN)
$2N24235: R21.1 U19.3(EMI)
$2N24238: Q6.1(B) R21.2
$2N24250: D10.2(A) K4.1 Q6.3(C)
$2N24525: LED5.1(+) U15.2(CAT)
$2N24526: R12.1 U15.1(AN)
$2N24529: R16.1 U15.3(EMI)
$2N24532: Q2.1(B) R16.2
$2N24544: D3.2(A) K2.1 Q2.3(C)
$2N25145: LED8.1(+) U21.2(CAT)
$2N25148: R23.1 U21.1(AN)
$2N25151: R25.1 U21.3(EMI)
$2N25161: Q7.1(B) R25.2
$2N25163: D11.2(A) K7.5 Q7.3(C)
$2N25822: LED10.1(+) U24.2(CAT)
$2N25825: R27.1 U24.1(AN)
$2N25828: R28.1 U24.3(EMI)
$2N25838: Q9.1(B) R28.2
$2N25840: D13.2(A) K9.5 Q9.3(C)
$2N26115: LED3.1(+) U16.2(CAT)
$2N26116: R13.1 U16.1(AN)
$2N26119: R17.1 U16.3(EMI)
$2N26122: Q3.1(B) R17.2
$2N26131: D7.2(A) K5.1 Q3.3(C)
$2N47435: LED4.1(+) U17.2(CAT)
$2N47436: R14.1 U17.1(AN)
$2N47437: R18.1 U17.3(EMI)
$2N47438: Q4.1(B) R18.2
$2N47446: D8.2(A) K6.1 Q4.3(C)
$2N52895: CN4.2 K5.2
$2N52927: CN4.1 K5.3
$2N65724: CN2.1 K1.3
$2N65899: CN3.2 K6.2
$2N65904: CN3.1 K6.3
Net-(U2-1): U2.1 U3.1(AC) U25.1

Not connected (* = marked no-connect by the designer): B1 A8(SBU1)* B8(SBU2)*; K3 2(COM)*; K7 2(COM)*; K9 2(COM)*; U5 16(IO46)* 26(IO45)* 28(IO35)* 29(IO36)* 30(IO37)* 32(IO39)* 33(IO40)* 34(IO41)* 35(IO42)*; U20 1* 2*; U22 1(S1)*

## Notes on the sheets
sheet 1
- AC Filter Circuit
- 3.3v LDO Unit
- AC To DC 5v
- EN
- RESET/BOOT
- MCU
- USB C
sheet 2
- 5A Circuit
- 5A Circuit
- 10A Circuit
- Dimmer Circuit
